# EasyEDA schematic SCH_Wireless_EMG_V2_2022-04-03.json
TITLE: Wireless EMG; REV: 1.0; Date: 2022-01-22; Sheet: 1/1; Drawn By: xaviercanoferrer
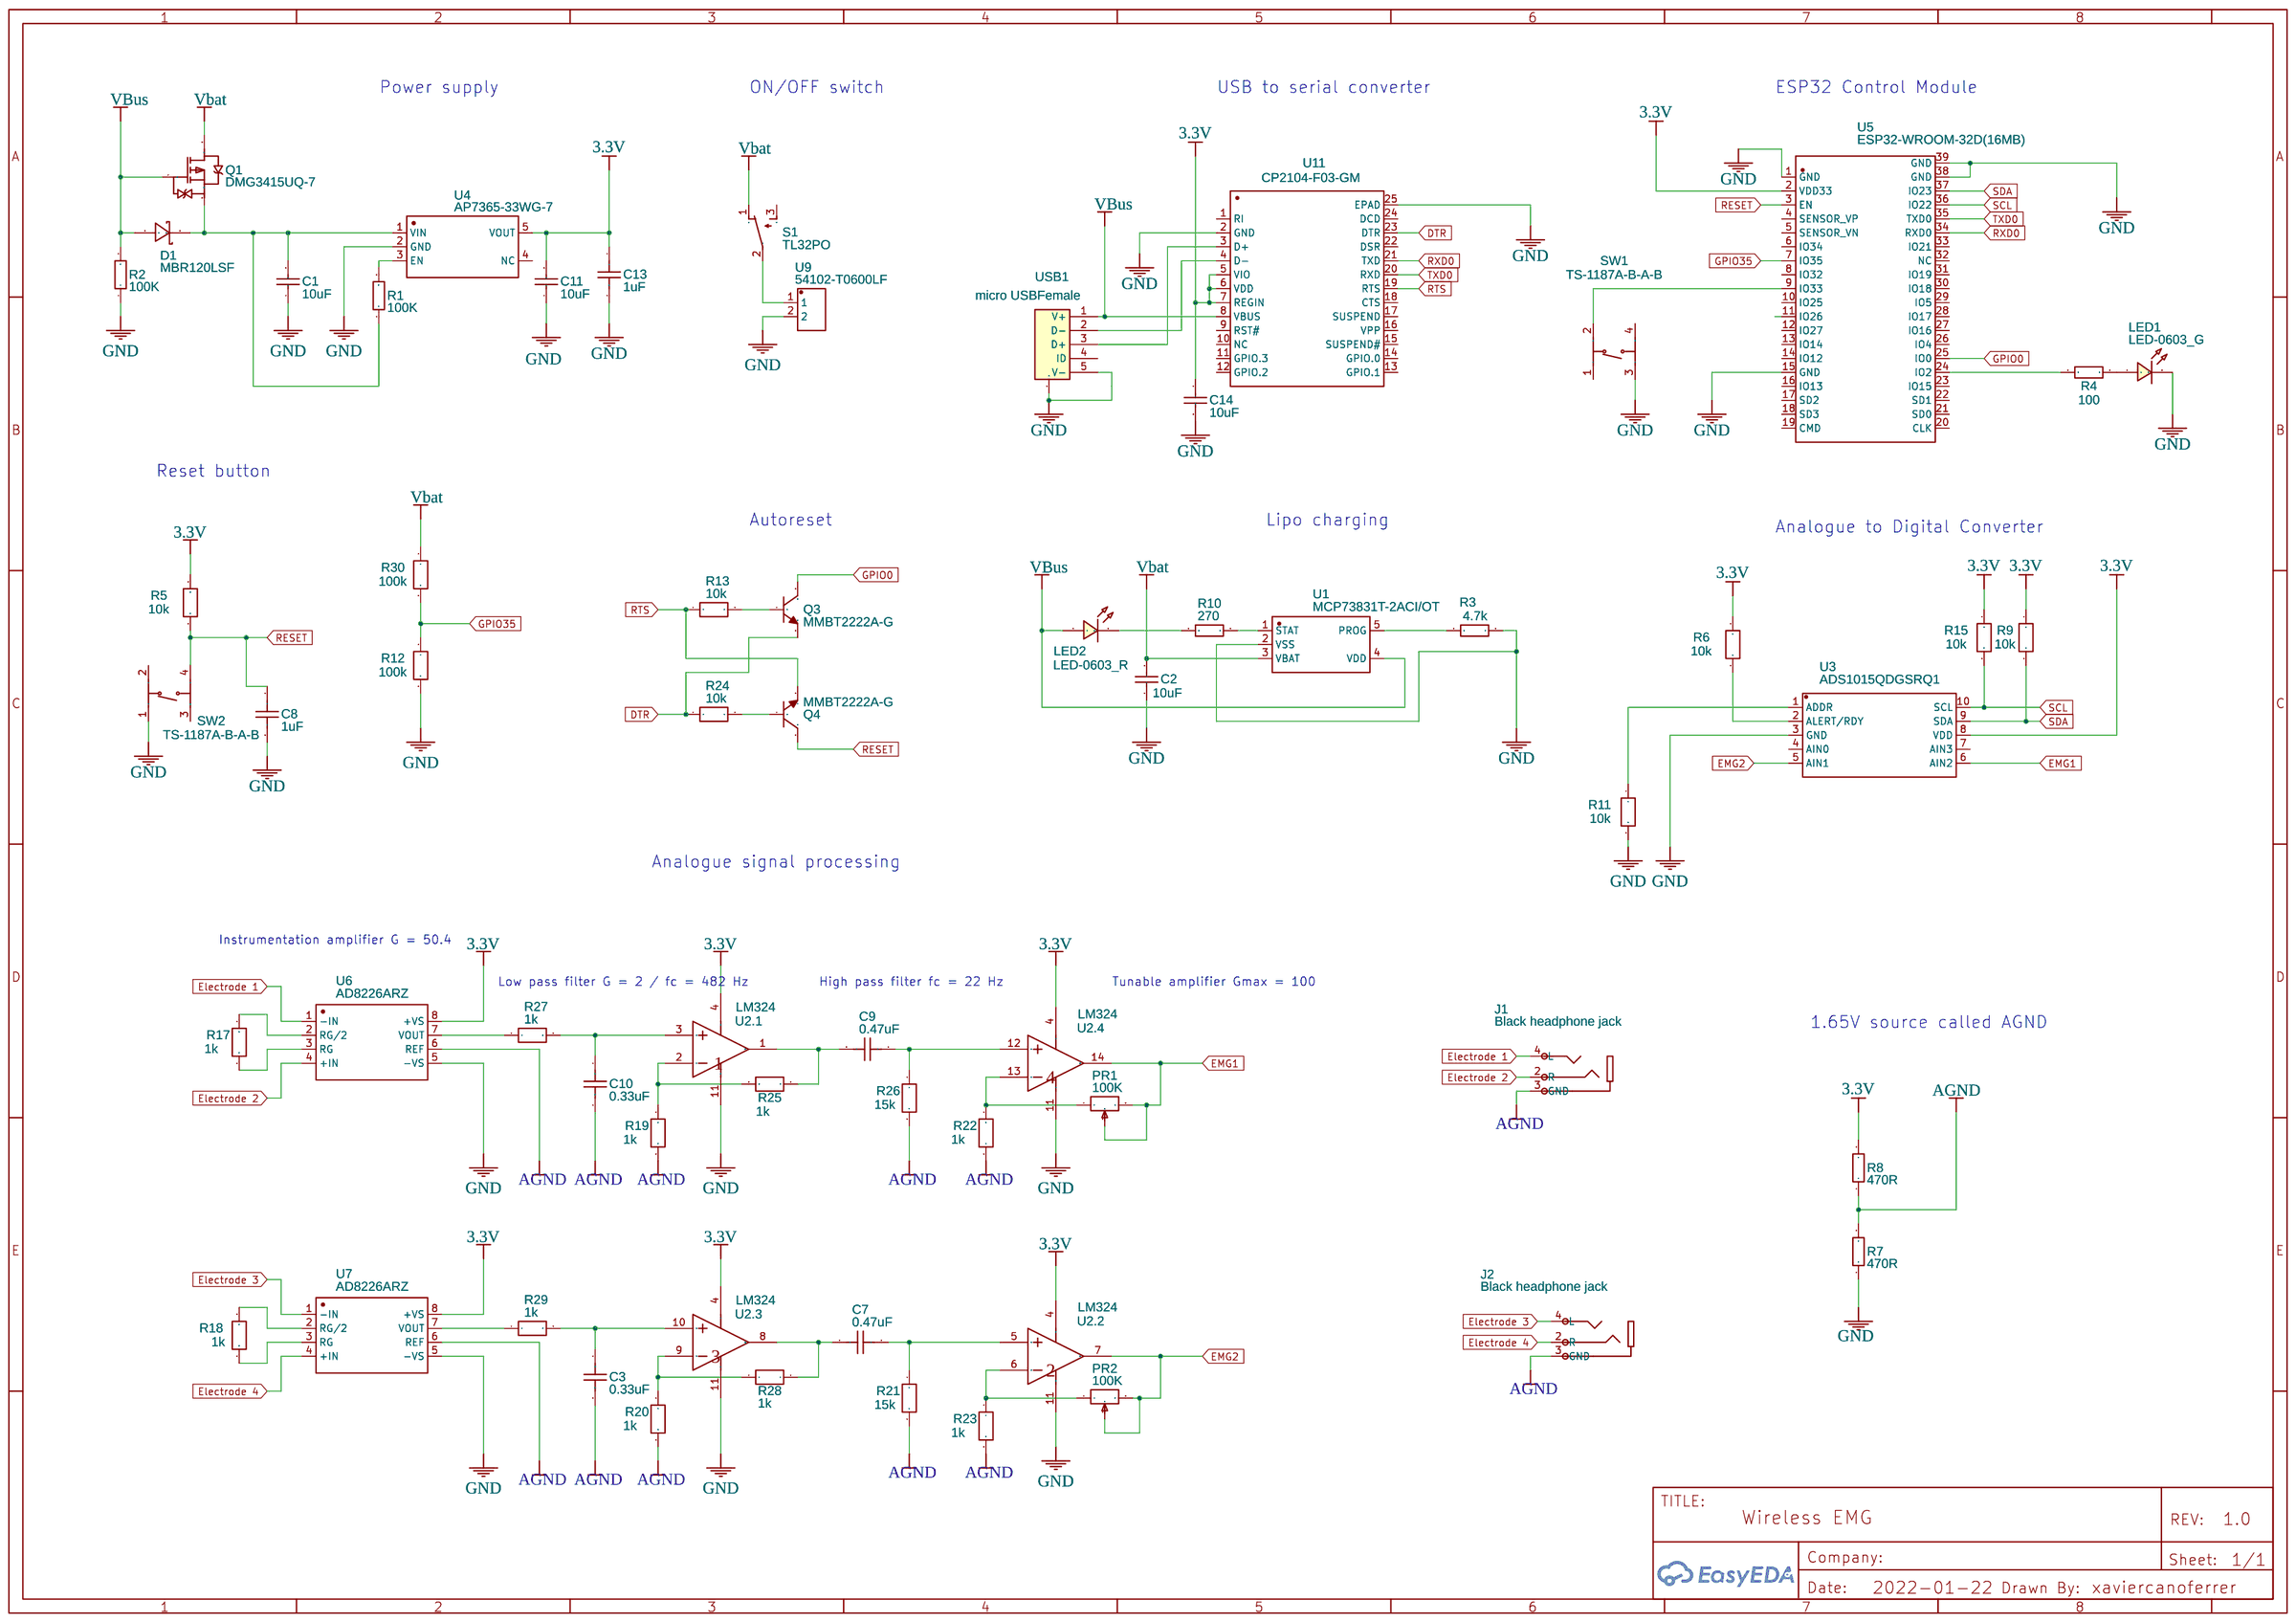
[diagram p0: schematic sheet]

## Parts
C1  10uF  [C0805]
C2  10uF  [C0805]
C3  0.33uF  [C0603]
C7  0.47uF  [C0603]
C8  1uF  [C0603]
C9  0.47uF  [C0603]
C10  0.33uF  [C0603]
C11  10uF  [C0805]
C13  1uF  [C0603]
C14  10uF  [C0805]
D1  MBR120LSF  [SOD-123_L2.8-W1.8-LS3.7-RD]
J1  Black headphone jack  [AUDIO-TH_PJ-3200]
J2  Black headphone jack  [AUDIO-TH_PJ-3200]
LED1  LED-0603_G  [LED0603_GREEN]
LED2  LED-0603_R  [LED0603_RED]
PR1  100K  [RES-ADJ-SMD_EVM3ESX50B25]
PR2  100K  [RES-ADJ-SMD_EVM3ESX50B25]
Q1  DMG3415UQ-7  [SOT-23-3_L2.9-W1.6-P1.90-LS2.8-BR]
Q3  MMBT2222A-G  [SOT-23-3_L2.9-W1.6-P1.90-LS2.8-BR]
Q4  MMBT2222A-G  [SOT-23-3_L2.9-W1.6-P1.90-LS2.8-BR]
R1  100K  [R0805]
R2  100K  [R0805]
R3  4.7k  [R0805]
R4  100  [R0805]
R5  10k  [R0603]
R6  10k  [R0603]
R7  470R  [R0805]
R8  470R  [R0805]
R9  10k  [R0603]
R10  270  [R0805]
R11  10k  [R0603]
R12  100k  [R0603]
R13  10k  [R0603]
R15  10k  [R0603]
R17  1k  [R0603]
R18  1k  [R0603]
R19  1k  [R0603]
R20  1k  [R0603]
R21  15k  [R0603]
R22  1k  [R0603]
R23  1k  [R0603]
R24  10k  [R0603]
R25  1k  [R0603]
R26  15k  [R0603]
R27  1k  [R0603]
R28  1k  [R0603]
R29  1k  [R0603]
R30  100k  [R0603]
S1  TL32PO  [TL3XPO]
SW1  TS-1187A-B-A-B  [SW-SMD_4P-L5.1-W5.1-P3.70-LS6.5-TL-2]
SW2  TS-1187A-B-A-B  [SW-SMD_4P-L5.1-W5.1-P3.70-LS6.5-TL-2]
U1  MCP73831T-2ACI/OT  [SOT-23-5_L3.0-W1.7-P0.95-LS2.8-BR]
U2  LM324  [SOIC-14_L8.7-W3.9-P1.27-LS6.0-BL]  (sections 1,2,3,4)
U3  ADS1015QDGSRQ1  [VSSOP-10_L3.0-W3.0-P0.50-LS4.9-BL]
U4  AP7365-33WG-7  [SOT-25_L3.0-W1.6-P0.95-LS2.8-BR]
U5  ESP32-WROOM-32D(16MB)  [WIFIM-SMD_39P-L25.5-W18.0-P1.27-BL]
U6  AD8226ARZ  [SOIC-8_L5.0-W4.0-P1.27-LS6.0-BL]
U7  AD8226ARZ  [SOIC-8_L5.0-W4.0-P1.27-LS6.0-BL]
U9  54102-T0600LF  [HDR-TH_2P-P2.54-V-M-R2-C1-S2.54]
U11  CP2104-F03-GM  [QFN-24_L4.0-W4.0-P0.50-BL-EP2.7]
USB1  micro USBFemale  [MICRO-USB-SMD_5P-P0.65-H-F_C10418]

## Library data of the parts
C1 C2 C14 = CL21A106KAYNNNE: Supplier: LCSC; Manufacturer: SAMSUNG; Supplier Part: C15850; JLCPCB Part Class: Basic Part
C3 C10 = C_0603_US: Supplier Part: C1615; Supplier: LCSC; Contributor: LCEDA_Lib; Manufacturer Part: 0603B334K250NT; Manufacturer: FH
C7 C9 = C_0603_US: Supplier Part: C1623; Supplier: LCSC; Contributor: LCEDA_Lib; Manufacturer Part: CL10B474KA8NNNC; Manufacturer: SAMSUNG
C8 C13 = C_0603_US: Supplier Part: C15849; Supplier: LCSC; Contributor: LCEDA_Lib; Manufacturer Part: CL10A105KB8NNNC; Manufacturer: SAMSUNG
C11 = CL21B105KBFNNNE: Supplier: LCSC; Manufacturer Part: CL21A106KAYNNNE; Manufacturer: SAMSUNG; Supplier Part: C15850; JLCPCB Part Class: Basic Part
D1 = MBR120LSF: Supplier: LCSC; Manufacturer: SK; Contributor: LCSC; Supplier Part: C130880; JLCPCB Part Class: Extended Part
J1 J2 = Black headphone jack: Supplier: LCSC; Manufacturer: BOOMELE; Supplier Part: C18166; JLCPCB Part Class: Extended Part
LED1 = LED-0603_G: Manufacturer: KENTO; Manufacturer Part: 0805G (Green); Supplier Part: C2297; Supplier: LCSC; Contributor: LCEDA_Lib
LED2 = LED-0603_R: Manufacturer: NATIONSTAR; Manufacturer Part: FC-2012HRK-620D; Supplier Part: C84256; Supplier: LCSC; Contributor: LCEDA_01
PR1 PR2 = EVM3ESX50B25: Supplier Part: C25803; Supplier: LCSC; Manufacturer: UniOhm; Manufacturer Part: 0603WAF1003T5E; Resistance(Ohms): 200K; JLCPCB Part Class: Extended Part
Q1 = DMG3415UQ-7: Supplier: LCSC; Supplier Part: C96616; Manufacturer: Diodes Incorporated; Manufacturer Part: DMG3415U-7; Contributor: LCSC; JLCPCB Part Class: Extended Part
Q3 Q4 = MMBT2222A-G: Supplier: LCSC; Manufacturer: CJ; Contributor: LCSC; Supplier Part: C164898; JLCPCB Part Class: Extended Part
R1 R2 = 0805W8F1002T5E: Supplier: LCSC; Manufacturer: YAGEO; Manufacturer Part: RC0805FR-07100KL; Supplier Part: C96346; JLCPCB Part Class: Basic Part
R3 = 0805W8F1500T5E: Supplier: LCSC; Manufacturer: Tyohm; Manufacturer Part: RMC08054.7K1%N; LCSC Assembly: Yes; Supplier Part: C269746; SMT Type: Basic
R4 = 0805W8F1500T5E: Supplier: LCSC; Manufacturer: YAGEO; Manufacturer Part: RC0805JR-07100RL; LCSC Assembly: Yes; Supplier Part: C106949; SMT Type: Basic
R5 R6 R9 R11 R13 R15 R24 = R_0603_EU: Supplier Part: C269701; Supplier: LCSC; Contributor: LCEDA_Lib; Manufacturer Part: RMC060310K1%N; Manufacturer: Tyohm
R7 R8 = 0805W8F1002T5E: Supplier: LCSC; Manufacturer: UniOhm; Manufacturer Part: 0805W8F4700T5E; Supplier Part: C17710; JLCPCB Part Class: Basic Part
R10 = 0805W8F1500T5E: Supplier: LCSC; Manufacturer: UniOhm; Manufacturer Part: 0805W8F2700T5E; LCSC Assembly: Yes; Supplier Part: C17590; SMT Type: Basic
R12 R30 = R_0603_EU: Supplier Part: C25803; Supplier: LCSC; Contributor: LCEDA_Lib; Manufacturer Part: 0603WAF1003T5E; Manufacturer: UniOhm
R17-R20 R22 R23 R25 R27-R29 = R_0603_EU: Supplier Part: C21190; Supplier: LCSC; Contributor: LCEDA_Lib; Manufacturer Part: 0603WAF1001T5E; Manufacturer: UniOhm
R21 R26 = R_0603_EU: Supplier Part: C100780; Supplier: LCSC; Contributor: LCEDA_Lib; Manufacturer Part: CR0603FA1502G; Manufacturer: LIZ
S1 = TL32PO: TINY SWITCH ON - MOM
SW1 SW2 = TS-1187A-B-A-B: Supplier: LCSC; Supplier Part: C318884; Manufacturer: XKB Enterprise; Contributor: LCSC; JLCPCB Part Class: Extended Part
U1 = MCP73831T-2ACI/OT: Supplier: LCSC; Supplier Part: C424093; Manufacturer: Microchip Tech; Contributor: LCSC; JLCPCB Part Class: Extended Part
U2 = LM324: Supplier: LCSC; Supplier Part: C351427; Manufacturer: PUOLOP; subpart_no: 1; JLCPCB Part Class: Extended Part
U3 = ADS1015QDGSRQ1: Supplier: LCSC; Supplier Part: C201686; Manufacturer: Texas Instruments; Contributor: LCSC; JLCPCB Part Class: Extended Part
U4 = AP7365-33WG-7: Supplier: LCSC; Manufacturer: DIODES; Contributor: LCSC; Supplier Part: C150742; JLCPCB Part Class: Extended Part
U5 = ESP32-WROOM-32D(16MB): Supplier: LCSC; Supplier Part: C473012; Manufacturer: ESPRESSIF 乐鑫; Manufacturer Part: ESP32-WROOM-32D; Contributor: LCSC; JLCPCB Part Class: Extended Part
U6 U7 = AD8226ARZ: Supplier: LCSC; Manufacturer: ADI; Supplier Part: C34250; JLCPCB Part Class: Extended Part
U9 = 54102-T0600LF: Supplier: LCSC; Supplier Part: C213465; Manufacturer: Amphenol ICC; Contributor: LCSC
U11 = CP2104-F03-GM: Supplier: LCSC; Manufacturer: SILICON LABS; Supplier Part: C47742; JLCPCB Part Class: Basic Part
USB1 = micro USBFemale: Supplier: LCSC; Manufacturer: ValuePro; Supplier Part: C10418; JLCPCB Part Class: Extended Part

## Nets
3.3V: C11.2 C13.1 C14.2 R5.1 R6.1 R8.2 R9.1 R15.1 U2.4(V-) U3.8(VDD) U4.5(VOUT) U5.2(VDD33) U6.8(+VS) U7.8(+VS) U11.5(VIO) U11.6(VDD) U11.7(REGIN)
AGND: C3.2 C10.2 J1.3(GND) J2.3(GND) R7.2 R8.1 R19.2 R20.2 R21.2 R22.2 R23.2 R26.2 U6.6(REF) U7.6(REF)
GND: C1.1 C2.1 C8.2 C11.1 C13.2 C14.1 LED1.2 R2.1 R3.1 R7.1 R11.2 R12.2 SW1.3(C) SW2.1(A) U1.2(VSS) U2.11(V+) U3.3(GND) U4.2(GND) U5.1(GND) U5.15(GND) U5.38(GND) U5.39(GND) U6.5(-VS) U7.5(-VS) U9.2 U11.2(GND) U11.25(EPAD) USB1.0(MTN) USB1.5(V-)
Vbat: C2.2 Q1.3(D) R30.1 S1.1(O) U1.3(VBAT)
VBus: D1.2(A) LED2.1 Q1.1(G) R2.2 U1.4(VDD) U11.8(VBUS) USB1.1(V+)
DTR: Q3.2(E) R24.1 U11.23(DTR)
Electrode 1: J1.4(L) U6.1(-IN)
Electrode 2: J1.2(R) U6.4(+IN)
Electrode 3: J2.4(L) U7.1(-IN)
Electrode 4: J2.2(R) U7.4(+IN)
EMG1: PR1.2 PR1.3 U2.14(OUT) U3.6(AIN2)
EMG2: PR2.2 PR2.3 U2.7(OUT) U3.5(AIN1)
GPIO0: Q3.3(C) U5.25(IO0)
GPIO35: R12.1 R30.2 U5.7(IO35)
RESET: C8.1 Q4.3(C) R5.2 SW2.4(D) U5.3(EN)
RTS: Q4.2(E) R13.1 U11.19(RTS)
RXD0: U5.34(RXD0) U11.21(TXD)
SCL: R15.2 U3.10(SCL) U5.36(IO22)
SDA: R9.2 U3.9(SDA) U5.37(IO23)
TXD0: U5.35(TXD0) U11.20(RXD)
Net-(C1-2): C1.2 D1.1(C) Q1.2(S) R1.1 U4.1(VIN)
Net-(C3-1): C3.1 R29.2 U2.10(IN+)
Net-(C7-1): C7.1 R21.1 U2.5(IN+)
Net-(C7-2): C7.2 R28.2 U2.8(OUT)
Net-(C9-1): C9.1 R26.1 U2.12(IN+)
Net-(C9-2): C9.2 R25.2 U2.1(OUT)
Net-(C10-1): C10.1 R27.2 U2.3(IN+)
Net-(LED1-1): LED1.1 R4.1
Net-(LED2-2): LED2.2 R10.2
Net-(PR1-1): PR1.1 R22.1 U2.13(IN-)
Net-(PR2-1): PR2.1 R23.1 U2.6(IN-)
Net-(Q3-1): Q3.1(B) R13.2
Net-(Q4-1): Q4.1(B) R24.2
Net-(R1-2): R1.2 U4.3(EN)
Net-(R3-2): R3.2 U1.5(PROG)
Net-(R4-2): R4.2 U5.24(IO2)
Net-(R6-2): R6.2 U3.2(ALERT/RDY)
Net-(R10-1): R10.1 U1.1(STAT)
Net-(R11-1): R11.1 U3.1(ADDR)
Net-(R17-1): R17.1 U6.2(RG/2)
Net-(R17-2): R17.2 U6.3(RG)
Net-(R18-1): R18.1 U7.3(RG)
Net-(R18-2): R18.2 U7.2(RG/2)
Net-(R19-1): R19.1 R25.1 U2.2(IN-)
Net-(R20-1): R20.1 R28.1 U2.9(IN-)
Net-(R27-1): R27.1 U6.7(VOUT)
Net-(R29-1): R29.1 U7.7(VOUT)
Net-(S1-2): S1.2(P) U9.1
Net-(SW1-2): SW1.2(B) U5.9(IO33)
Net-(U11-3): U11.3(D+) USB1.3(D+)
Net-(U11-4): U11.4(D-) USB1.2(D-)

Not connected (* = marked no-connect by the designer): S1 3(S); SW1 1(A) 4(D); SW2 2(B) 3(C); U3 4(AIN0) 7(AIN3); U4 4(NC); U5 4(SENSOR_VP) 5(SENSOR_VN) 6(IO34) 8(IO32) 10(IO25) 11(IO26) 12(IO27) 13(IO14) 14(IO12) 16(IO13) 17(SD2) 18(SD3) 19(CMD) 20(CLK) 21(SD0) 22(SD1) 23(IO15) 26(IO4) 27(IO16) 28(IO17) 29(IO5) 30(IO18) 31(IO19) 32(NC) 33(IO21); U11 1(RI) 9(RST#) 10(NC) 11(GPIO.3) 12(GPIO.2) 13(GPIO.1) 14(GPIO.0) 15(SUSPEND#) 16(VPP) 17(SUSPEND) 18(CTS) 22(DSR) 24(DCD); USB1 4(ID)

## Notes on the sheet
- Power supply
- ON/OFF switch
- USB to serial converter
- ESP32 Control Module
- Reset button
- Autoreset
- Lipo charging
- Analogue to Digital Converter
- Analogue signal processing
- Instrumentation amplifier G = 50.4
- Low pass filter G = 2 / fc = 482 Hz
- High pass filter fc = 22 Hz
- Tunable amplifier Gmax = 100
- 1.65V source called AGND
